# Altium schematic sheet Sensor.SchDoc
size A4
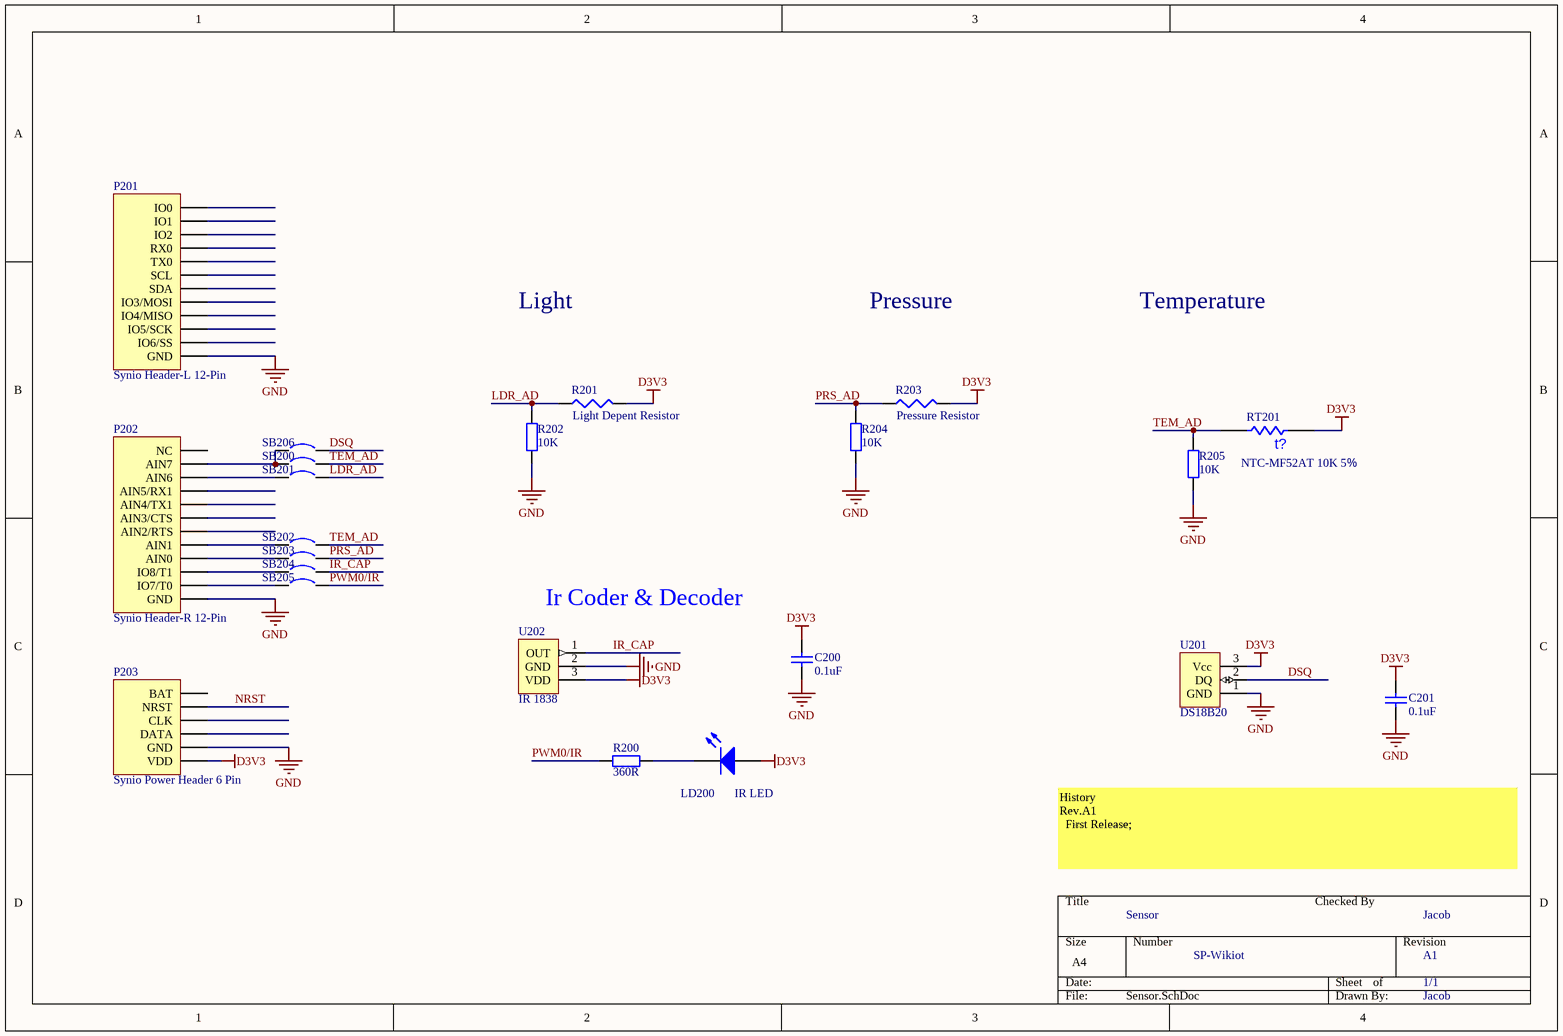
[diagram p0: Sensor.SchDoc]

## Parts
C200  0.1uF  [0603M]
C201  0.1uF  [0603M]
LD200  IR LED  [HDR1X2/2.54mm]
P201  Synio Header-L 12-Pin  [HDR1X12]
P202  Synio Header-R 12-Pin  [HDR1X12]
P203  Synio Power Header 6 Pin  [HDR1X6/2.54MM]
R200  360R  [0603M]
R201  value Light Depent Resistor  [AXIAL-0.4]  (hidden comment: Res3)
R202  10K  [R0603]
R203  value Pressure Resistor  [HDR1X2/2.54mm]  (hidden comment: Res3)
R204  10K  [R0603]
R205  10K  [R0603]
RT201  NTC-MF52AT 10K 5％  [HDR1X2/2.54mm]
SB200  Circuit Breaker  [JP2_SMD]  (value not drawn)
SB201  Circuit Breaker  [JP2_SMD]  (value not drawn)
SB202  Circuit Breaker  [JP2_SMD]  (value not drawn)
SB203  Circuit Breaker  [JP2_SMD]  (value not drawn)
SB204  Circuit Breaker  [JP2_SMD]  (value not drawn)
SB205  Circuit Breaker  [JP2_SMD]  (value not drawn)
SB206  Circuit Breaker  [JP2_SMD]  (value not drawn)
U201  DS18B20  [TO92]
U202  IR 1838  [TSOP18]

## Nets
D3V3: C200.2 C201.2 LD200.1(A) P203.1(VDD) R201.2 R203.2 RT201.1 U201.3(Vcc) U202.3(VDD)
GND: C200.1 C201.1 P201.1(GND) P202.1(GND) P203.2(GND) R202.1 R204.1 R205.1 U201.1(GND) U202.2(GND)
DSQ: SB206.2 U201.2(DQ)
IR_CAP: SB204.2 U202.1(OUT)
LDR_AD: R201.1 R202.2 SB201.2
NRST: P203.5(NRST)
PRS_AD: R203.1 R204.2 SB203.2
PWM0/IR: R200.2 SB205.2
TEM_AD: R205.2 RT201.2 SB200.2 SB202.2
NetLD200_2: LD200.2(K) R200.1
NetP202_2: P202.2(IO7/T0) SB205.1
NetP202_3: P202.3(IO8/T1) SB204.1
NetP202_4: P202.4(AIN0) SB203.1
NetP202_5: P202.5(AIN1) SB202.1
NetP202_10: P202.10(AIN6) SB201.1
NetP202_11: P202.11(AIN7) SB200.1 SB206.1

Not connected (* = marked no-connect by the designer): P201 2(IO6/SS) 3(IO5/SCK) 4(IO4/MISO) 5(IO3/MOSI) 6(SDA) 7(SCL) 8(TX0) 9(RX0) 10(IO2) 11(IO1) 12(IO0); P202 6(AIN2/RTS) 7(AIN3/CTS) 8(AIN4/TX1) 9(AIN5/RX1) 12(NC); P203 3(DATA) 4(CLK) 6(BAT)

## Notes on the sheet
- Light
- Pressure
- Temperature
- Ir Coder & Decoder
- History
  Rev.A1
  First Release;
- Sensor
- Checked By
- Jacob
- SP-Wikiot
- A1
- 1/1
- (in symbol Res Thermal) t?

## Library data of the parts
C200 C201 = Cap: Capacitor; Published: 8-Jun-2000; LatestRevisionDate: 17-Jul-2002; LatestRevisionNote: Re-released for DXP Platform.; PackageReference: RAD-0.3; Publisher: Altium Limited; Value: 0.1uF
LD200 = LED: Typical RED, GREEN, YELLOW, AMBER GaAs LED; Published: 8-Jun-2000; LatestRevisionDate: 17-Jul-2002; LatestRevisionNote: Re-released for DXP Platform.; PackageDocument: Feb-2002; PackageReference: 3.2X1.6X1.1; Publisher: Altium Limited
P201 = Synio Header-L 12-Pin: Synio Header-L, 12-Pin; LatestRevisionDate: 17-Jul-2002; LatestRevisionNote: Re-released for DXP Platform.; Publisher: Altium Limited
P202 = Synio Header-R 12-Pin: Synio Header-R, 12-Pin; LatestRevisionDate: 17-Jul-2002; LatestRevisionNote: Re-released for DXP Platform.; Publisher: Altium Limited
R200 = Res: Resistor; Published: 8-Jun-2000; LatestRevisionDate: 17-Jul-2002; LatestRevisionNote: Re-released for DXP Platform.; PackageReference: AXIAL-0.4; Publisher: Altium Limited; Value: 360R
R201 R203 = Res3: Resistor; Published: 8-Jun-2000; LatestRevisionDate: 29-May-2009; LatestRevisionNote: IPC-7351 Footprint Added.; PackageReference: J1-0603; Publisher: Altium Limited; PackageDescription: Chip Resistor
R202 R204 R205 = Res2: Resistor; Published: 8-Jun-2000; LatestRevisionDate: 17-Jul-2002; LatestRevisionNote: Re-released for DXP Platform.; PackageReference: AXIAL-0.4; Publisher: Altium Limited; Value: 10K
RT201 = Res Thermal: Thermistor; Published: 24-Mar-1999; LatestRevisionDate: 29-May-2009; LatestRevisionNote: IPC-7351 Footprint Added.; PackageVersion: Mar-2003; PackageReference: 6-0805; Publisher: Altium Limited; PackageDescription: Chip Resistor 0805 Case Size; Code_IPC: RESC2012
SB200-SB206 = Circuit Breaker: Solder: YES; Published: 24-Mar-1999; Revision: July-2002: Re-released for DXP Platform.; Publisher: Altium Limited
U201 = DS18B20: Programmable Resolution  1-Wire Digital Thermometer; LatestRevisionDate: 17-Jul-2002; LatestRevisionNote: Re-released for DXP Platform.; Publisher: Altium Limited
U202 = 1838: Photo Modules for PCM Remote Control Systems; LatestRevisionDate: 17-Jul-2002; LatestRevisionNote: Re-released for DXP Platform.; Publisher: Altium Limited